# Altium schematic sheet RemoteIMU.SchDoc: Remote IMU
size Letter; DocumentNumber: 1; Revision: 1; SheetNumber: 1; SheetTotal: 3; Client: Facebook; LeaflabsProject: Sawyer
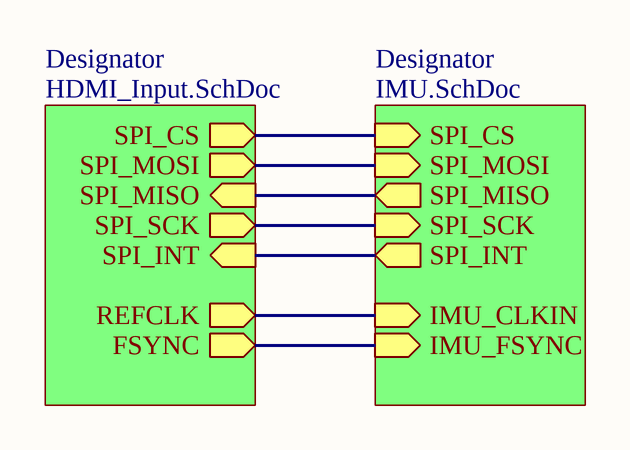
[diagram p0: RemoteIMU.SchDoc]

## Sub-sheets
Designator = IMU.SchDoc: SPI_MOSI (in), SPI_SCK (in), SPI_MISO (out), IMU_CLKIN (in), SPI_INT (out), IMU_FSYNC (in), SPI_CS (in)
Designator = HDMI_Input.SchDoc: SPI_CS (out), REFCLK (out), SPI_MOSI (out), SPI_MISO (in), FSYNC (out), SPI_SCK (out), SPI_INT (in)

## Nets
(unnamed): sheet Designator/SPI_MOSI, sheet Designator/SPI_MOSI
(unnamed): sheet Designator/SPI_SCK, sheet Designator/SPI_SCK
(unnamed): sheet Designator/SPI_MISO, sheet Designator/SPI_MISO
(unnamed): sheet Designator/IMU_CLKIN, sheet Designator/REFCLK
(unnamed): sheet Designator/SPI_INT, sheet Designator/SPI_INT
(unnamed): sheet Designator/IMU_FSYNC, sheet Designator/FSYNC
(unnamed): sheet Designator/SPI_CS, sheet Designator/SPI_CS

## Notes on the sheet
- PROJ
- TITLE
- CLIENT
- REV
- DATE
- LeafLabs
- SHEET
- OF
- CONFIDENTIAL. DO NOT DISTRIBUTE.